# EAGLE schematic T09_LockBox_ver5.0 (EAGLE 7.7.0)
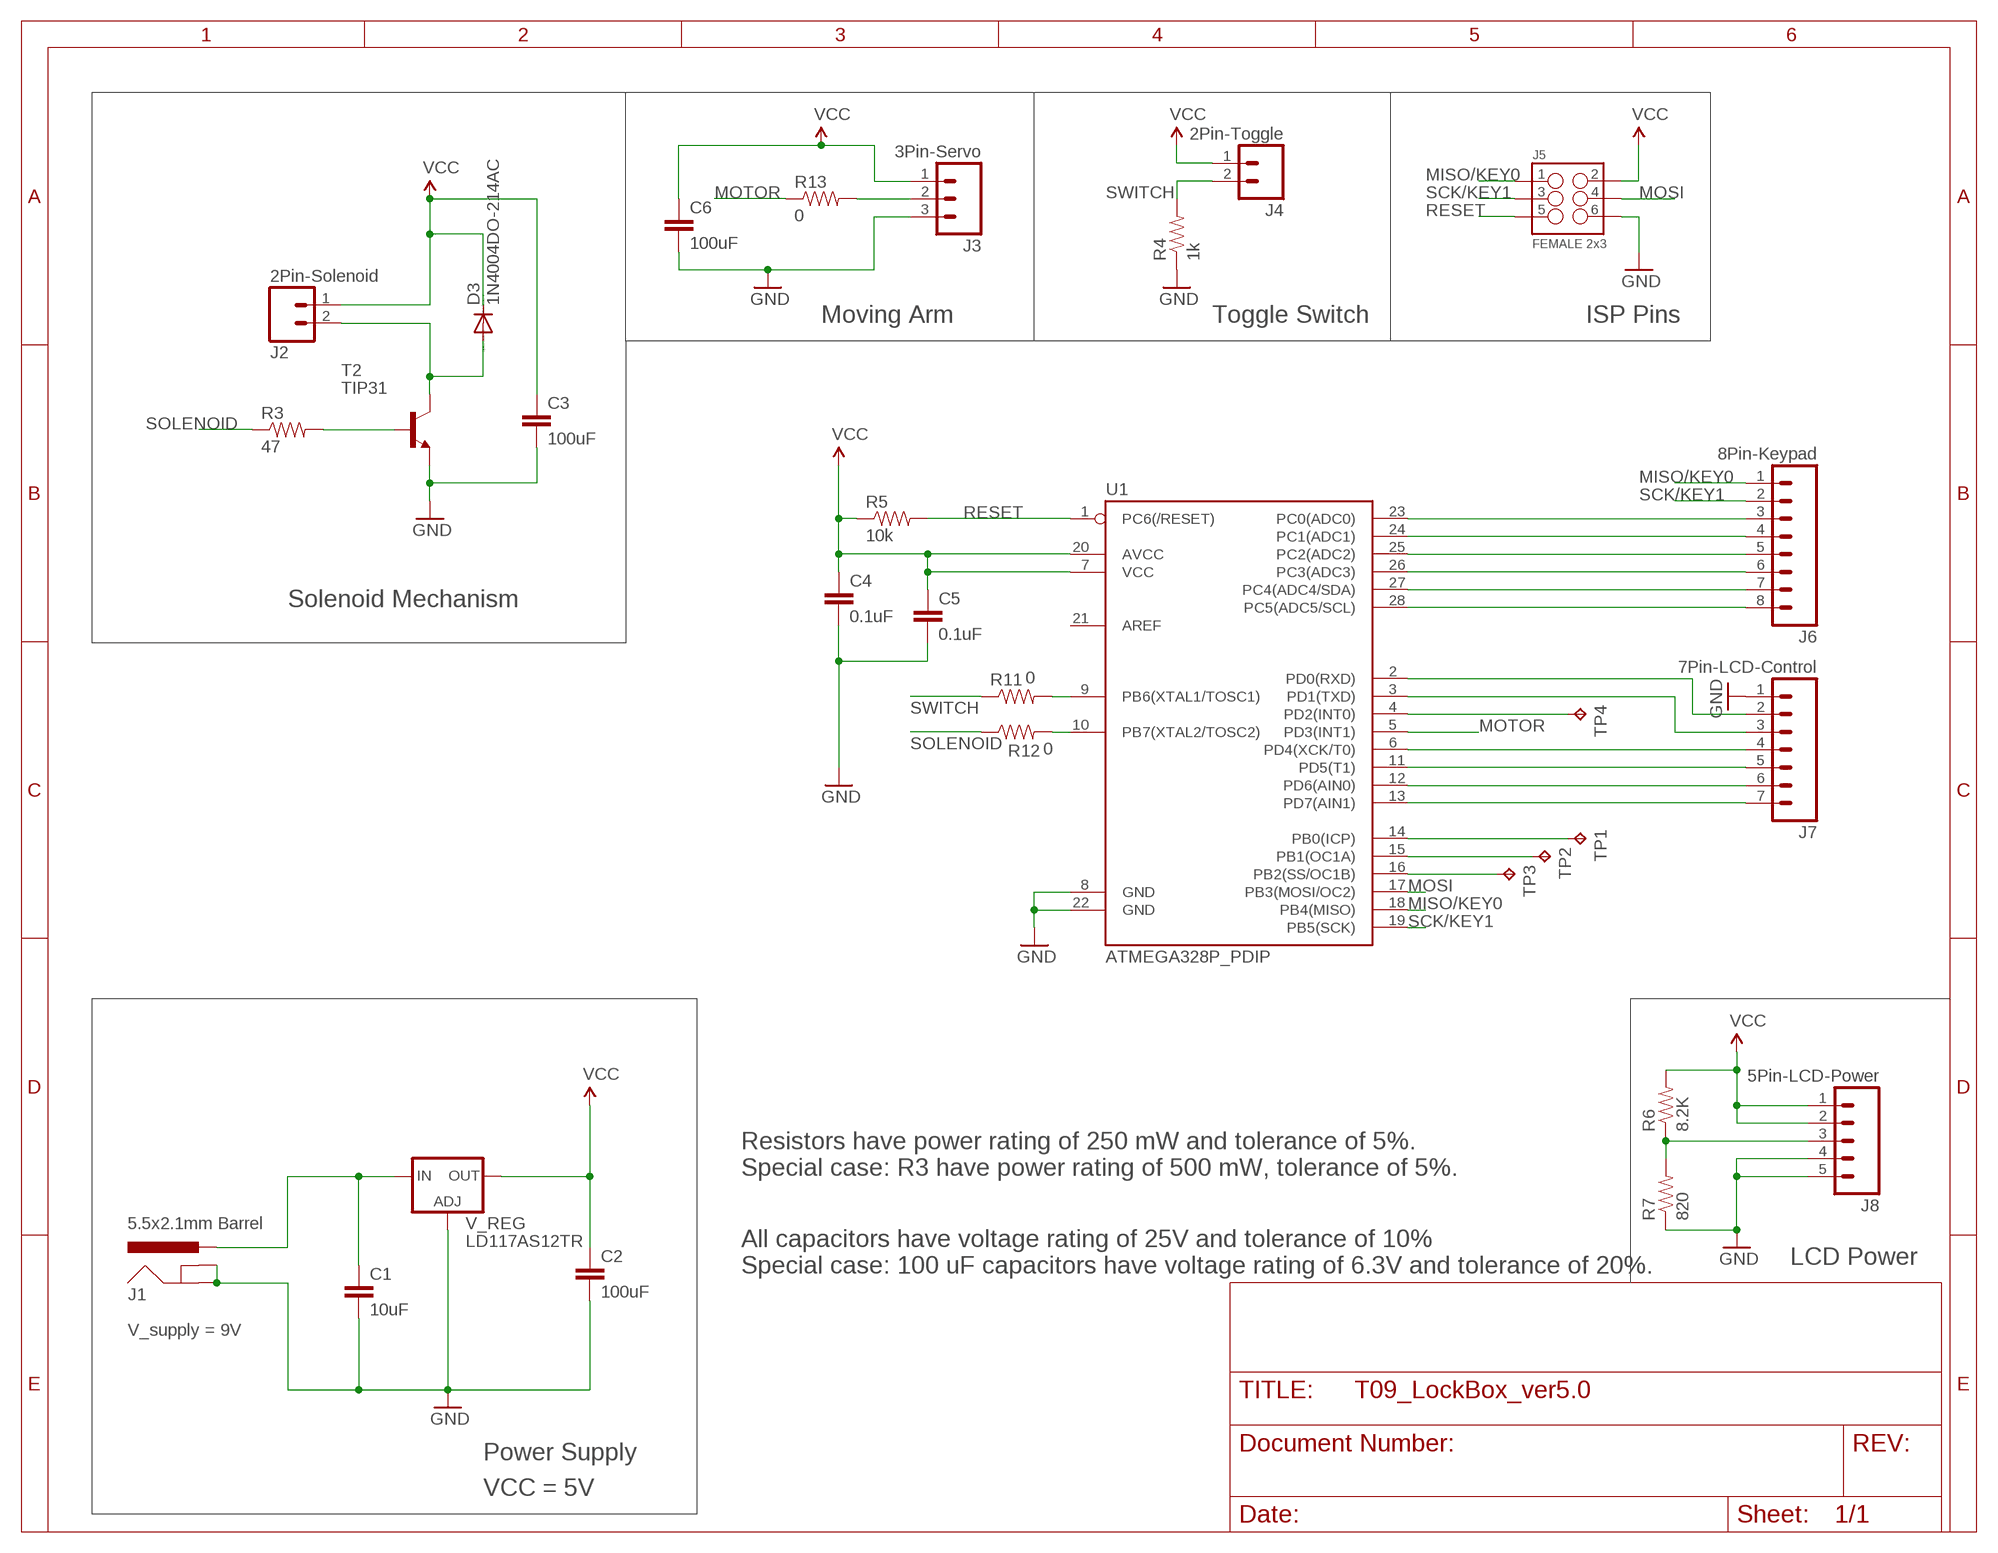
[diagram p0: schematic, sheet 1]

## Parts
C1  10uF  CAP0603-CAP  [0603-CAP]
C2  100uF  CAP0603-CAP  [0603-CAP]
C3  100uF  CAP0603-CAP  [0603-CAP]
C4  0.1uF  CAP0603-CAP  [0603-CAP]
C5  0.1uF  CAP0603-CAP  [0603-CAP]
C6  100uF  CAP0603-CAP  [0603-CAP]
D3  1N4004DO-214AC  [DO-214AC]
J1  5.5x2.1mm Barrel  POWER_JACKSMD  [POWER_JACK_SMD]
J2  2Pin-Solenoid  M02PTH  [1X02]
J3  3Pin-Servo  M03PTH  [1X03]
J4  2Pin-Toggle  M02PTH  [1X02]
J5  FEMALE 2x3  M03X2FEMALE  [2X3]
J6  8Pin-Keypad  M08  [1X08_ROUND]
J7  7Pin-LCD-Control  M07  [1X07]
J8  5Pin-LCD-Power  M05PTH  [1X05]
R3  47  RESISTOR0805-RES  [0805]
R4  1k  RESISTOR0603  [0603-RES]
R5  10k  RESISTOR0603  [0603-RES]
R6  8.2K  RESISTOR0603  [0603-RES]
R7  820  RESISTOR0603  [0603-RES]
R11  0  RESISTOR0603  [0603-RES]
R12  0  RESISTOR0603  [0603-RES]
R13  0  RESISTOR0603  [0603-RES]
T2  TIP31  [TO220]
TP1  TPPAD1-13  [P1-13]
TP2  TPPAD1-13  [P1-13]
TP3  TPPAD1-13  [P1-13]
TP4  TPPAD1-13  [P1-13]
U1  ATMEGA328P_PDIP  [DIL28-3]
V_REG  LD117AS12TR  [SOT223]

## Nets
GND: C1.2 C2.2 C3.2 C4.2 C5.2 C6.2 J1.GND(GNDBREAK) J1.P$4(GND) J3.3 J5.6 J7.1 J8.4 J8.5 R4.1 R7.1 T2.3(E) U1.8(GND) U1.22(GND) V_REG.1(ADJ)
MISO/KEY0: J5.1 J6.1 U1.18(PB4(MISO))
MOSI: J5.4 U1.17(PB3(MOSI/OC2))
MOTOR: R13.1 U1.5(PD3(INT1))
N$1: D3.A J2.2 T2.2(C)
N$2: J8.3 R6.1 R7.2
N$5: R3.2 T2.1(B)
N$8: J7.2 U1.2(PD0(RXD))
N$9: R11.2 U1.9(PB6(XTAL1/TOSC1))
N$10: R12.2 U1.10(PB7(XTAL2/TOSC2))
N$11: J3.2 R13.2
N$12: J7.3 U1.3(PD1(TXD))
N$13: J7.4 U1.6(PD4(XCK/T0))
N$14: J7.5 U1.11(PD5(T1))
N$15: J7.6 U1.12(PD6(AIN0))
N$16: J7.7 U1.13(PD7(AIN1))
N$17: J6.3 U1.23(PC0(ADC0))
N$18: J6.4 U1.24(PC1(ADC1))
N$19: J6.5 U1.25(PC2(ADC2))
N$20: J6.6 U1.26(PC3(ADC3))
N$21: J6.7 U1.27(PC4(ADC4/SDA))
N$22: J6.8 U1.28(PC5(ADC5/SCL))
N$24: TP4.TP U1.4(PD2(INT0))
N$25: TP1.TP U1.14(PB0(ICP))
N$26: TP2.TP U1.15(PB1(OC1A))
N$27: TP3.TP U1.16(PB2(SS/OC1B))
RESET: J5.5 R5.2 U1.1(PC6(/RESET))
SCK/KEY1: J5.3 J6.2 U1.19(PB5(SCK))
SOLENOID: R3.1 R12.1
SWITCH: J4.2 R4.2 R11.1
VCC: C2.1 C3.1 C4.1 C5.1 C6.1 D3.C J2.1 J3.1 J4.1 J5.2 J8.1 J8.2 R5.1 R6.2 U1.7(VCC) U1.20(AVCC) V_REG.4(OUT)
VIN: C1.1 J1.VIN0(PWR) V_REG.3(IN)
Unconnected: U1.21(AREF)

## Notes on the sheet
- Moving Arm | Toggle Switch | ISP Pins
- Solenoid Mechanism
- Resistors have power rating of 250 mW and tolerance of 5%.
  Special case: R3 have power rating of 500 mW, tolerance of 5%.
- LCD Power
- All capacitors have voltage rating of 25V and tolerance of 10% 
  Special case: 100 uF capacitors have voltage rating of 6.3V and tolerance of 20%.
- V_supply = 9V
- Power Supply
- VCC = 5V

## Library data of the parts
C1-C6 = SparkFun-Passives:CAP: Capacitor Standard 0603 ceramic capacitor, and 0.1" leaded capacitor.
D3 = diode:1N4004: DIODE general purpose rectifier, 1 A
J1 = SparkFun-Connectors:POWER_JACK: Power Jack This is the standard 5.5mm barrel jack for power. The PTH is the most common, proven, reliable, footprint. The Slot footprint only works if the mill layer is transmitted to the PCB fab house so be warned. Mating wall wart : TOL-00298 (and others); PROD_ID: CONN-08106; SF_ID: PRT-12748
J2 J4 = SparkFun-Connectors:M02: Standard 2-pin 0.1" header. Use with - straight break away headers ( PRT-00116) - right angle break away headers (PRT-00553) - swiss pins (PRT-00743) - machine pins (PRT-00117) - female headers (PRT-00115) Molex polarized connector foot print use with: PRT-08233 with associated crimp pins and housings. 2.54_SCREWTERM for use with PRT-10571. 3.5mm Screw Terminal footprints for PRT-08084 5mm Screw Terminal footprints for use with PRT-08432
J3 = SparkFun-Connectors:M03: Header 3 Standard 3-pin 0.1" header. Use with straight break away headers (SKU : PRT-00116), right angle break away headers (PRT-00553), swiss pins (PRT-00743), machine pins (PRT-00117), and female headers (PRT-00115). Molex polarized connector foot print use with SKU : PRT-08232 with associated crimp pins and housings.
J5 = SparkFun-Connectors:M03X2: 2x3 .1" header. Shrouded, with keying- CONN-10681 SMT- CONN-11415 Pogo pins- HW-11044; PROD_ID: CONN-11566
J6 = SparkFun-Connectors:M08: Header 8 Standard 8-pin 0.1" header. Use with straight break away headers (SKU : PRT-00116), right angle break away headers (PRT-00553), swiss pins (PRT-00743), machine pins (PRT-00117), and female headers (PRT-00115).; PROD_ID: CONN-08437
J7 = SparkFun-Connectors:M07: Header 7 Standard 7-pin 0.1" header. Use with straight break away headers (SKU : PRT-00116), right angle break away headers (PRT-00553), swiss pins (PRT-00743), machine pins (PRT-00117), and female headers (PRT-00115). NOTES ON THE VARIANTS LOCK and LOCK_LONGPADS... This footprint was designed to help hold the alignment of a through-hole component (i.e. 7-pin header) while soldering it into place. You may notice that each hole has been shifted either up or down by 0.005 of an inch from it's more standard position (which is usually a perfectly straight line). This slight alteration caused the pins (the squares in the middle) to touch the edges of the holes. Because they are alternating, it causes a "brace" to hold the header in place. 0.005 has proven to be the perfect amount of "off-center" position when using our standard breakaway headers. Although looks a little odd when you look at the bare footprint, once you have a header in there, the alteration is very hard to notice. Also, if you push a header all the way into place, it is covered up entirely on the bottom side. This idea of altering the position of holes to aid alignment will be further integrated into the Sparkfun Library for other footprints. It can help hold any component with 3 or more connection pins.
J8 = SparkFun-Connectors:M05: Header 5 Standard 5-pin 0.1" header. Use with straight break away headers (SKU : PRT-00116), right angle break away headers (PRT-00553), swiss pins (PRT-00743), machine pins (PRT-00117), and female headers (PRT-00115). Molex polarized connector foot print use with SKU : PRT-08230 with associated crimp pins and housings.
R3-R7 R11-R13 = SparkFun-Resistors:RESISTOR: Resistor Basic schematic elements and footprints for 0603, 1206, and PTH resistors.
T2 = transistor:TIP31: NPN Transistor Medium Power Linear Switching Applications Source: http://onsemi.com
TP1-TP4 = testpad:TP: Test pad
U1 = SparkFun-DigitalIC:ATMEGA328P_PDIP: uC used in the Arduino 32kb flash, 1k EEPROM, 2k SRAM This is the through-hole version of this chip.
V_REG = v-reg:LD117A?*: Low drop fixed and adjustable positive voltage regulators 1 A Source: http://www.st.com/stonline/products/literature/ds/7194/ld1117axx.pdf